# EAGLE design Piglet v1.5.3 (EAGLE 7.7.0)
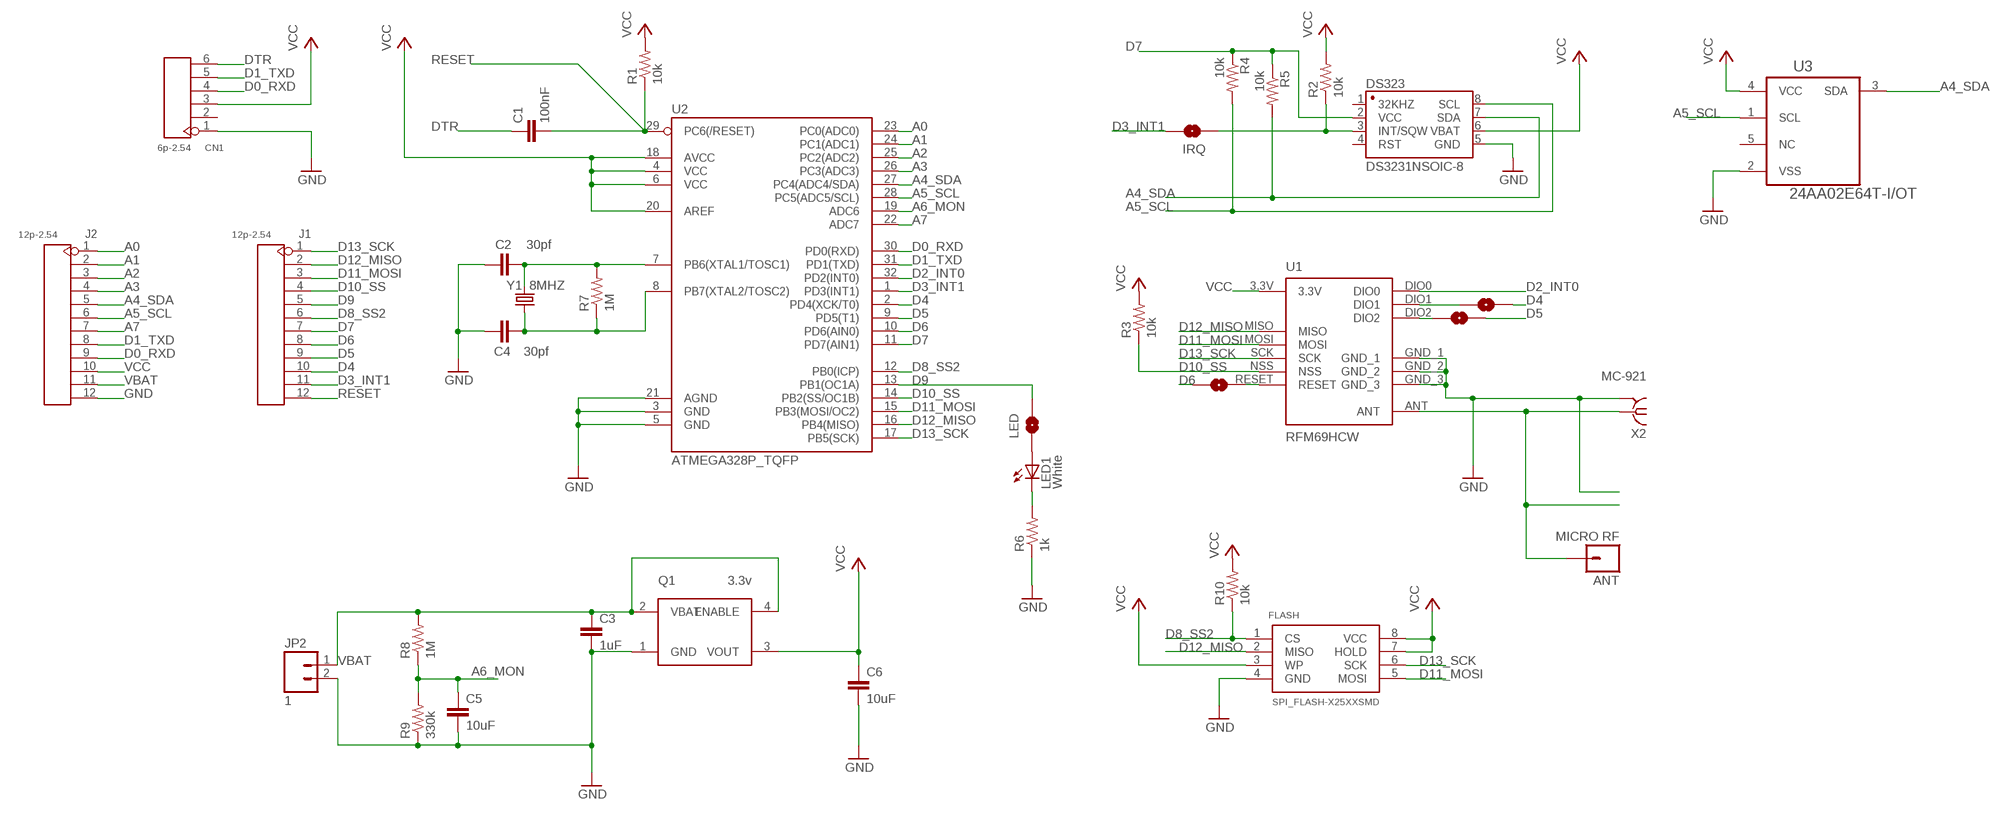
[diagram p0: schematic, sheet 1]

## Parts
ANT  MICRO RF  M01PTH  [1X01]
C1  100nF  CAP0805  [0805]
C2  30pf  CAP0805  [0805]
C3  1uF  CAP0805  [0805]
C4  30pf  CAP0805  [0805]
C5  10uF  CAP0805  [0805]
C6  10uF  CAP0805  [0805]
CN1  6p-2.54  DIP-BLACK-FEMALE-HEADER-VERT(6P-2.54)  [H6-2.54]
DS323  DS3231NSOIC-8  [DS3231MZ+TRL]
FLASH  SPI_FLASH-X25XXSMD  [SO08]
IRQ  SOLDERJUMPERNO  [SJ_2S-NO]
IRQ0  SOLDERJUMPERNO  [SJ_2S-NO]
IRQ1  SOLDERJUMPERNO  [SJ_2S-NO]
IRQ2  SOLDERJUMPERNO  [SJ_2S-NO]
J1  12p-2.54  DIP-BLACK-FEMALE-HEADER-VERT(12P-2.54)  [H12-2.54]
J2  12p-2.54  DIP-BLACK-FEMALE-HEADER-VERT(12P-2.54)  [H12-2.54]
JP2  1  MICRO_JST_2W  [M_JST_90_SMD_2]
LED  SOLDERJUMPERNO  [SJ_2S-NO]
LED1  White  LEDCHIPLED_0805  [CHIPLED_0805]
Q1  3.3v  NCP662SOT143  [SOT143]
R1  10k  RESISTOR0805-RES  [0805]
R2  10k  RESISTOR0805-RES  [0805]
R3  10k  RESISTOR0805-RES  [0805]
R4  10k  RESISTOR0805-RES  [0805]
R5  10k  RESISTOR0805-RES  [0805]
R6  1k  RESISTOR0805-RES  [0805]
R7  1M  RESISTOR0805-RES  [0805]
R8  1M  RESISTOR0805-RES  [0805]
R9  330k  RESISTOR0805-RES  [0805]
R10  10k  RESISTOR0805-RES  [0805]
U1  RFM69HCW  [RFM69HCW-XXXS2]
U2  ATMEGA328P_TQFP  [TQFP32-08]
U3  24AA02E64T-I/OT  [SOT95P270X145-5N]
X2  MC-921  [MC-921]
Y1  8MHZ  CRYSTALTXC-7A  [CRYSTAL-TXC-7A]

## Nets
A0: J2.1 U2.23(PC0(ADC0))
A1: J2.2 U2.24(PC1(ADC1))
A2: J2.3 U2.25(PC2(ADC2))
A3: J2.4 U2.26(PC3(ADC3))
A4_SDA: DS323.7(SDA) J2.5 R5.2 U2.27(PC4(ADC4/SDA)) U3.3(SDA)
A5_SCL: DS323.8(SCL) J2.6 R4.2 U2.28(PC5(ADC5/SCL)) U3.1(SCL)
A6_MON: C5.1 R8.1 R9.2 U2.19(ADC6)
A7: J2.7 U2.22(ADC7)
ANT: ANT.1 U1.ANT X2.1
D0_RXD: CN1.4 J2.9 U2.30(PD0(RXD))
D1_TXD: CN1.5 J2.8 U2.31(PD1(TXD))
D2_INT0: U1.DIO0 U2.32(PD2(INT0))
D3_INT1: IRQ.2 J1.11 U2.1(PD3(INT1))
D4: IRQ0.1 J1.10 U2.2(PD4(XCK/T0))
D5: IRQ2.1 J1.9 U2.9(PD5(T1))
D6: IRQ1.2 J1.8 U2.10(PD6(AIN0))
D7: DS323.2(VCC) J1.7 R4.1 R5.1 U2.11(PD7(AIN1))
D8_SS2: FLASH.1(CS) J1.6 R10.1 U2.12(PB0(ICP))
D9: J1.5 LED.2 U2.13(PB1(OC1A))
D10_SS: J1.4 R3.1 U1.NSS U2.14(PB2(SS/OC1B))
D11_MOSI: FLASH.5(MOSI) J1.3 U1.MOSI U2.15(PB3(MOSI/OC2))
D12_MISO: FLASH.2(MISO) J1.2 U1.MISO U2.16(PB4(MISO))
D13_SCK: FLASH.6(SCK) J1.1 U1.SCK U2.17(PB5(SCK))
DTR: C1.1 CN1.6
GND: C2.1 C3.2 C4.1 C5.2 C6.2 CN1.1 DS323.5(GND) FLASH.4(GND) J2.12 JP2.2 Q1.1(GND) R6.1 R9.1 U1.GND_1 U1.GND_2 U1.GND_3 U2.3(GND) U2.5(GND) U2.21(AGND) U3.2(VSS) X2.2@1(GND) X2.2@2(GND)
N$1: LED1.C R6.2
N$3: IRQ2.2 U1.DIO2
N$4: DS323.3(INT/SQW) IRQ.1 R2.1
N$5: C2.2 R7.2 U2.7(PB6(XTAL1/TOSC1)) Y1.P$2
N$6: C4.2 R7.1 U2.8(PB7(XTAL2/TOSC2)) Y1.P$1
N$8: LED1.A LED.1
N$9: IRQ0.2 U1.DIO1
N$11: IRQ1.1 U1.RESET
RESET: C1.2 J1.12 R1.1 U2.29(PC6(/RESET))
VBAT: C3.1 J2.11 JP2.1 Q1.2(VBAT) Q1.4(ENABLE) R8.2
VCC: C6.1 CN1.3 DS323.6(VBAT) FLASH.3(WP) FLASH.7(HOLD) FLASH.8(VCC) J2.10 Q1.3(VOUT) R1.2 R2.2 R3.2 R10.2 U1.3.3V U2.4(VCC) U2.6(VCC) U2.18(AVCC) U2.20(AREF) U3.4(VCC)
Unconnected: CN1.2 DS323.1(32KHZ) DS323.4(RST) U3.5(NC)

## Library data of the parts
ANT = SparkFun-Connectors:M01: Header 1 Standard 1-pin 0.1" header. Use with straight break away headers (SKU : PRT-00116), right angle break away headers (PRT-00553), swiss pins (PRT-00743), machine pins (PRT-00117), and female headers (PRT-00115).
C1-C6 = doug:CAP: Capacitor Standard 0603 ceramic capacitor, and 0.1" leaded capacitor.
CN1 = Seeed-OPL-Connector:DIP-BLACK-FEMALE-HEADER-VERT(6P-2.54): 320030060; MPN: F185-1106A1BSYC1
DS323 = doug:DS3231: A placeholder for generic narrow & wide SOIC8 foorptints - used on the DIP adapter board.; PROD_ID: IC-10141
FLASH = SparkFun-DigitalIC:SPI_FLASH-X25XX: 8pin SPI Flash series x25xx. Works with devices like W25X32 and BR25L32
IRQ IRQ0 IRQ1 IRQ2 LED = SparkFun-Retired:SOLDERJUMPER: Solder Jumper Standard SMD solder jumper. Used to automate production. Two varients : Normally Open and Normally Closed are the same, but have different paste layers. NC will have a large amount of paste and should jumper during reflow.
J1 J2 = Seeed-OPL-Connector:DIP-BLACK-FEMALE-HEADER-VERT(12P-2.54): 320030117; MPN: F185-1112A0BSYA1
JP2 = doug:MICRO_JST_2W: Header 5 Standard 5-pin 0.1" header. Use with straight break away headers (SKU : PRT-00116), right angle break away headers (PRT-00553), swiss pins (PRT-00743), machine pins (PRT-00117), and female headers (PRT-00115). Molex polarized connector foot print use with SKU : PRT-08230 with associated crimp pins and housings.
LED1 = led:LED: LED OSRAM: - CHIPLED LG R971, LG N971, LY N971, LG Q971, LY Q971, LO R971, LY R971 LH N974, LH R974 LS Q976, LO Q976, LY Q976 LO Q996 - Hyper CHIPLED LW Q18S LB Q993, LB Q99A, LB R99A - SideLED LS A670, LO A670, LY A670, LG A670, LP A670 LB A673, LV A673, LT A673, LW A673 LH A674 LY A675 LS A676, LA A676, LO A676, LY A676, LW A676 LS A679, LY A679, LG A679 - Hyper Micro SIDELED® LS Y876, LA Y876, LO Y876, LY Y876 LT Y87S - SmartLED LW L88C, LW L88S LB L89C, LB L89S, LG L890 LS L89K, LO L89K, LY L89K LS L896, LA L896, LO L896, LY L896 - TOPLED LS T670, LO T670, LY T670, LG T670, LP T670 LSG T670, LSP T670, LSY T670, LOP T670, LYG T670 LG T671, LOG T671, LSG T671 LB T673, LV T673, LT T673, LW T673 LH T674 LS T676, LA T676, LO T676, LY T676, LB T676, LH T676, LSB T676, LW T676 LB T67C, LV T67C, LT T67C, LS T67K, LO T67K, LY T67K, LW E67C LS E67B, LA E67B, LO E67B, LY E67B, LB E67C, LV E67C, LT E67C LW T67C LS T679, LY T679, LG T679 LS T770, LO T770, LY T770, LG T770, LP T770 LB T773, LV T773, LT T773, LW T773 LH T774 LS E675, LA E675, LY E675, LS T675 LS T776, LA T776, LO T776, LY T776, LB T776 LHGB T686 LT T68C, LB T68C - Hyper Mini TOPLED® LB M676 - Mini TOPLED Santana® LG M470 LS M47K, LO M47K, LY M47K Source: http://www.osram.convergy.de LUXEON: - LUMILED® LXK2-PW12-R00, LXK2-PW12-S00, LXK2-PW14-U00, LXK2-PW14-V00 LXK2-PM12-R00, LXK2-PM12-S00, LXK2-PM14-U00 LXK2-PE12-Q00, LXK2-PE12-R00, LXK2-PE12-S00, LXK2-PE14-T00, LXK2-PE14-U00 LXK2-PB12-K00, LXK2-PB12-L00, LXK2-PB12-M00, LXK2-PB14-N00, LXK2-PB14-P00, LXK2-PB14-Q00 LXK2-PR12-L00, LXK2-PR12-M00, LXK2-PR14-Q00, LXK2-PR14-R00 LXK2-PD12-Q00, LXK2-PD12-R00, LXK2-PD12-S00 LXK2-PH12-R00, LXK2-PH12-S00 LXK2-PL12-P00, LXK2-PL12-Q00, LXK2-PL12-R00 Source: www.luxeon.com KINGBRIGHT: KA-3528ASYC Source: www.kingbright.com
Q1 = doug:NCP662: NCP662 100 mA CMOS Low Iq Low-Dropout Voltage Regulator
R1-R10 = doug:RESISTOR: Resistor Basic schematic elements and footprints for 0603, 1206, and PTH resistors.
U1 = doug:RFM69H
U2 = doug:ATMEGA328P_TQFP; PROD_ID: IC-09069
U3 = Microchip-24AA02E64T-I_OT:24AA02E64T-I/OT: 2K I2C™ Serial EEPROMs, SOT23-5; MPN: 24AA02E64T-I/OT; OC_FARNELL: 2345567; OC_NEWARK: 01X0461; PACKAGE: SOT23-5; SUPPLIER: Microchip
X2 = con-coax:MC-921: COAX. MICROWAVE CONNECTOR O/D diam 2.1 Source: www.tycoelectronics.com .. Electronics .. ENG_CD_1775146_A2.pdf; OC_FARNELL: unknown; OC_NEWARK: unknown
Y1 = SparkFun-FreqCtrl:CRYSTAL: Various standard crystals. Proven footprints.

## Board
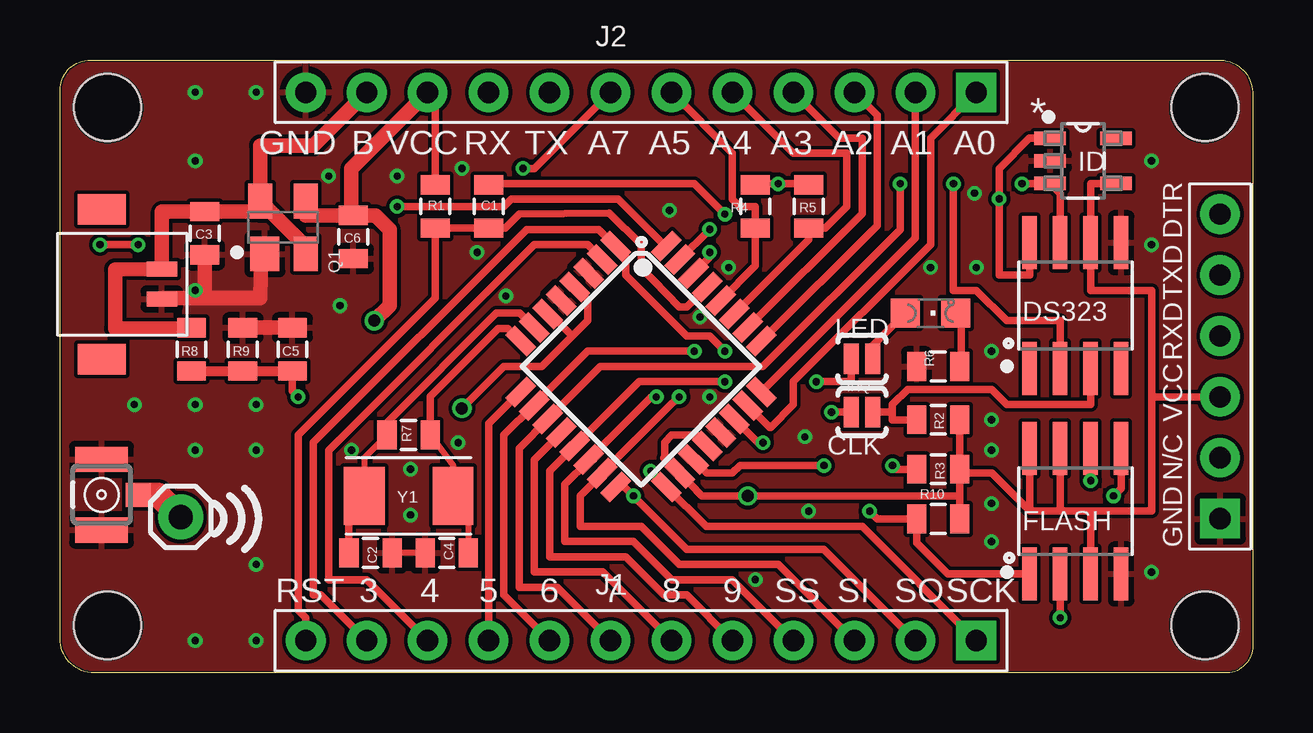
[diagram p1: board, top side]
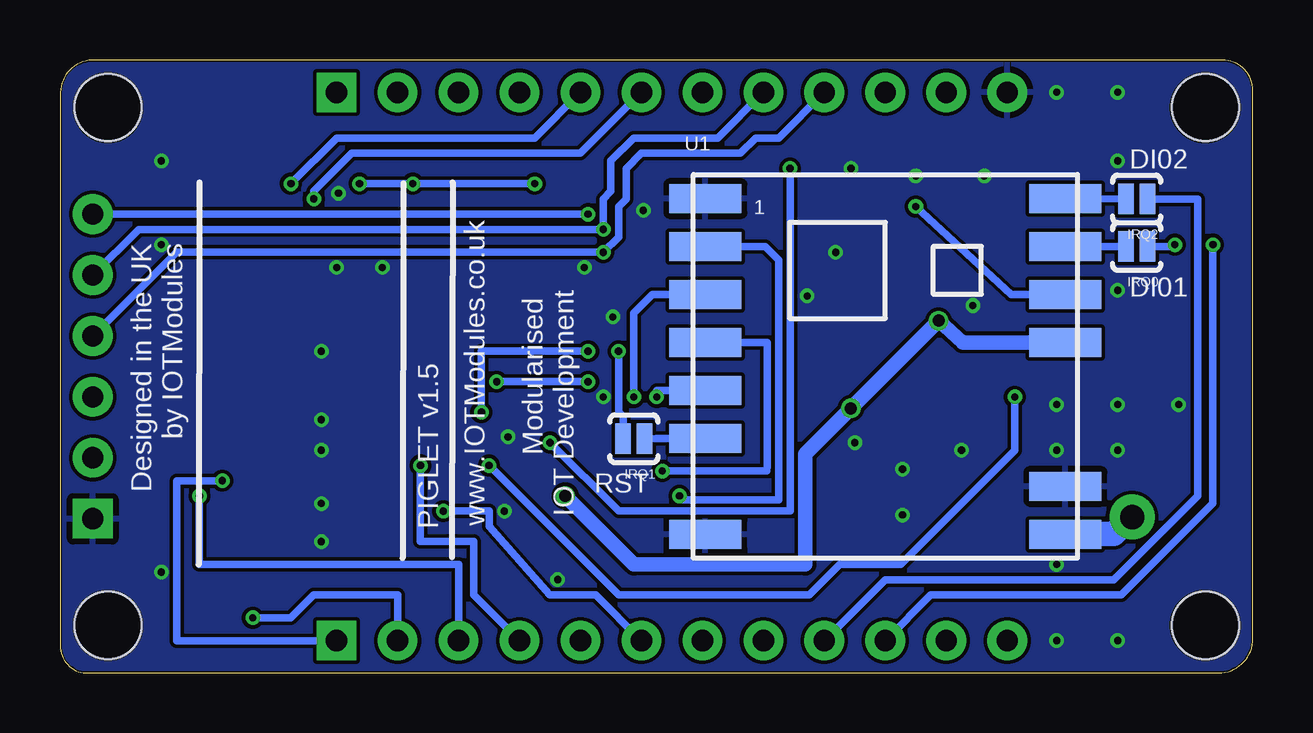
[diagram p2: board, bottom side, seen from below]

Size 49.71 x 25.56 mm. Coordinates in mm from the lower left corner, seen from the top.
Outline: 0,1.43 0,24.29 arc-90 1.27,25.56 48.26,25.56 arc-90 49.69,24.21 49.69,1.35 arc-90 48.74,0 1.43,0 arc-90 0,1.43
Copper layers (1*16): Top 0.035mm / dielectric 1.5mm / Bottom 0.035mm
Design rules "SeeedStudio_2layer_DRU_no_angle_20140221 *": minimum track width 6mil, minimum drill 0.3mm, track to track 6mil, track to pad 6mil, pad to pad 6mil, via to via 6mil, smd to smd 0mil, copper to edge 3mil, drill to drill 10mil, minimum pad ring 10mil, minimum via ring 6mil, stop-mask expansion 2mil, vias tented up to drill 100mil, thermal gap 10mil
Holes 2.8 mm at 1.98,23.57 1.98,1.98 47.7,23.57 47.7,1.98

### Footprints (pad centres in the part's own frame; a part is rotated, then mirrored left to right if it is on the bottom)
1X01 = drill 1.016 pad 1.88: 1 0,0
0805 = smd 0.8 x 1.2: 1 -0.9,0; 2 0.9,0
H6-2.54 = drill 0.889 pad 1.651 square: 1 0,6.35 | drill 0.889 pad 1.651: 2 0,3.81; 3 0,1.27; 4 0,-1.27; 5 0,-3.81; 6 0,-6.35
DS3231MZ+TRL = smd 0.61 x 2.21: 1 -1.905,-2.616; 2 -0.635,-2.616; 3 0.635,-2.616; 4 1.905,-2.616; 5 1.905,2.616; 6 0.635,2.616; 7 -0.635,2.616; 8 -1.905,2.616
SO08 = smd 0.61 x 2.21: 1 -1.905,-2.616; 2 -0.635,-2.616; 3 0.635,-2.616; 4 1.905,-2.616; 5 1.905,2.616; 6 0.635,2.616; 7 -0.635,2.616; 8 -1.905,2.616
SJ_2S-NO = smd 0.635 x 1.27: 1 -0.45,0; 2 0.45,0
H12-2.54 = drill 0.889 pad 1.651 square: 1 0,13.97 | drill 0.889 pad 1.651: 2 0,11.43; 3 0,8.89; 4 0,6.35; 5 0,3.81; 6 0,1.27; 7 0,-1.27; 8 0,-3.81; 9 0,-6.35; 10 0,-8.89; 11 0,-11.43; 12 0,-13.97
M_JST_90_SMD_2 = smd 0.635 x 1.27: 1 4.375,2.5; 2 3.125,2.5 | smd 1.27 x 2: P$1 0.625,5; P$2 6.875,5
CHIPLED_0805 = smd 1.2 x 1.2: A 0,-1.05; C 0,1.05
SOT143 = smd 1.2 x 1.44: 1 -0.75,-1.1 | smd 1 x 1.44: 2 0.95,-1.1; 3 0.95,1.1; 4 -0.95,1.1
RFM69HCW-XXXS2 = smd 3 x 1.2: 3.3V 7.5,1; ANT 7.5,-7; DIO0 7.5,3; DIO1 7.5,5; DIO2 7.5,7; GND_1 7.5,-5; GND_2 -7.5,-7; GND_3 -7.5,7; MISO -7.5,5; MOSI -7.5,3; NSS -7.5,-1; RESET -7.5,-3; SCK -7.5,1
TQFP32-08 = smd 1.27 x 0.559: 1 -4.293,2.8; 2 -4.293,2; 3 -4.293,1.2; 4 -4.293,0.4; 5 -4.293,-0.4; 6 -4.293,-1.2; 7 -4.293,-2; 8 -4.293,-2.8; 17 4.293,-2.8; 18 4.293,-2; 19 4.293,-1.2; 20 4.293,-0.4; 21 4.293,0.4; 22 4.293,1.2; 23 4.293,2; 24 4.293,2.8 | smd 0.559 x 1.27: 9 -2.8,-4.293; 10 -2,-4.293; 11 -1.2,-4.293; 12 -0.4,-4.293; 13 0.4,-4.293; 14 1.2,-4.293; 15 2,-4.293; 16 2.8,-4.293; 25 2.8,4.293; 26 2,4.293; 27 1.2,4.293; 28 0.4,4.293; 29 -0.4,4.293; 30 -1.2,4.293; 31 -2,4.293; 32 -2.8,4.293
SOT95P270X145-5N = smd 1.321 x 0.559: 1 -1.372,0.94; 2 -1.372,0; 3 -1.372,-0.94; 4 1.372,-0.94; 5 1.372,0.94
MC-921 = smd 1 x 1.05: 1 0,1.528 | smd 1.05 x 2.2: 2@1 -1.475,0; 2@2 1.475,0
CRYSTAL-TXC-7A = smd 1.7 x 2.4: P$1 1.85,0; P$2 -1.85,0

### Placement (x,y rotation side)
ANT  5.03,6.5 0 top
C1  17.86,19.45 270 top
C2  12.94,5 180 top
C3  6.03,18.34 270 top
C4  16.11,5 0 top
C5  9.68,13.49 90 top
C6  12.22,18.18 270 top
CN1  48.34,12.78 180 top
DS323  42.31,15.32 0 top
FLASH  42.31,6.75 0 top
IRQ  33.42,10.87 180 top
IRQ0  4.84,17.78 180 bottom
IRQ1  25.8,9.76 180 bottom
IRQ2  4.84,19.76 180 bottom
J1  24.21,1.35 270 top
J2  24.21,24.21 270 top
JP2  6.75,12.46 90 top
LED  33.42,13.1 180 top
LED1  36.27,15 270 top
Q1  9.29,18.57 0 top
R1  15.64,19.45 90 top
R2  36.59,10.56 0 top
R3  36.59,8.49 0 top
R4  28.97,19.45 270 top
R5  31.19,19.45 270 top
R6  36.59,12.78 0 top
R7  14.53,9.92 180 top
R8  5.48,13.49 90 top
R9  7.62,13.49 270 top
R10  36.59,6.43 0 top
U1  15.32,12.78 0 bottom
U2  24.21,12.78 315 top
U3  42.62,21.35 0 top
X2  1.73,7.43 270 top
Y1  14.53,7.38 0 top

### Tracks (layer width: path | path; a pad name or v marks a point on that pad's centre or on a via)
A0
  Top 0.305: U2.23 29.58,10.24 29.61,10.24 30.56,11.19 30.56,12.14 36.27,17.86 36.27,22.3 J2.1
A1
  Top 0.305: U2.24 35.64,18.14 J2.2
A2
  Top 0.305: U2.25 34.05,18.66 34.05,23.26 J2.3
A3
  Top 0.305: U2.26 33.42,19.16 33.42,22.3 32.46,22.3 J2.4
A4_SDA  (via drill 0.3)
  Top 0.305: U2.27 31.19,18.07 R5.2 31.88,18.55 32.78,19.45 32.78,21.67 30.56,21.67 J2.5 | v40.08,20.4 40.71,20.41 U3.3 41.67,19.99 DS323.7
  Bottom 0.305: v40.08,20.4 38.18,22.3 29.92,22.3 J2.5
A5_SCL  (via drill 0.3)
  Top 0.305: U2.28 28.97,16.98 R4.2 28.97,19.45 28.34,19.45 28.02,19.76 28.02,21.67 J2.6 | DS323.8 40.4,16.59 39.13,16.59 v39.13,19.76 39.13,21.03 40.39,22.29 U3.1
  Bottom 0.305: J2.6 28.02,21.67 37.54,21.67 39.13,20.08 v39.13,19.76
A6_MON  (via drill 0.3)
  Top 0.305: 26.51,8.9 U2.19 26.96,8.33 28.02,8.33 28.34,8.65 v31.83,8.65 | v9.92,11.51 9.68,11.75 C5.1
  Top 0.406: R8.1 R9.2 C5.1
  Bottom 0.305: v31.83,8.65 26.43,3.25 18.49,3.25 17.22,4.52 14.68,4.52 9.92,9.29 v9.92,11.51
A7  (via drill 0.3)
  Top 0.305: v19.29,21.03 19.76,21.03 J2.7 | U2.22 29.08,9.6 v29.29,9.6
  Bottom 0.305: v29.29,9.6 26.43,6.75 19.29,6.75 v19.29,21.03
ANT
  Top 1.016: ANT.1 4.1,7.43 X2.1
  Bottom 0.61: ANT.1 5.09,6.5 | 7.8,5.79 U1.ANT
  Bottom 1.016: 5.09,6.5 5.79,5.79 7.8,5.79
D0_RXD  (via drill 0.3)
  Top 0.305: v27.07,17.54 27.07,17.33 U2.30
  Bottom 0.305: CN1.4 44.85,17.54 v27.07,17.54 26.43,18.18 26.43,19.45 26.11,19.76 26.11,21.03 25.48,21.67 21.35,21.67 20.72,22.3 19.76,22.3 J2.9
D1_TXD  (via drill 0.3)
  Top 0.305: U2.31 25.83,17.26 v27.07,18.49
  Bottom 0.305: CN1.5 46.43,18.49 v27.07,18.49 27.07,19.76 26.75,20.08 26.75,21.35 25.8,22.3 22.3,22.3 J2.8
D2_INT0  (via drill 0.3)
  Top 0.305: U2.32 25.23,17.79 23.26,19.76 18.81,19.76 18.49,19.45 v14.05,19.45
  Bottom 0.305: v14.05,19.45 10.06,15.78 U1.DIO0
D3_INT1  (via drill 0.3)
  Top 0.305: U2.1 23.15,17.96 | J1.11 10.87,3.25 10.56,3.25 10.56,9.6 19.45,18.49 22.45,18.49 U2.1 | v27.7,13.41 27.07,14.05 26.11,14.05 23.57,16.59 23.57,17.37 U2.1 | v32.15,10.87 IRQ.2
  Bottom 0.305: v27.7,13.41 32.15,13.41 v32.15,10.87
D4  (via drill 0.3)
  Top 0.305: U2.2 22.59,17.26 21.99,17.86 19.76,17.86 11.19,9.29 11.19,3.89 12.78,3.89 J1.10 | v3.25,17.86 v1.67,17.86
  Bottom 0.305: J1.10 13.41,3.25 5.48,3.25 1.67,7.06 v1.67,17.86 | v3.25,17.86 3.33,17.78 IRQ0.1
D5
  Top 0.305: J1.9 17.86,10.4 U2.9
  Bottom 0.305: IRQ2.1 2.3,19.76 2.3,7.38 5.79,3.89 15.32,3.89 J1.9
D6  (via drill 0.3)
  Top 0.305: J1.8 18.49,3.25 18.49,9.92 19.73,11.16 U2.10 19.76,11.19 21.99,13.41 v26.43,13.41
  Bottom 0.305: v26.43,13.41 26.43,10.87 26.25,10.69 IRQ1.2
D7  (via drill 0.3)
  Top 0.305: J1.7 20.72,3.57 19.13,3.57 19.13,9.37 20.33,10.56 U2.11 | U2.11 20.33,10.72 | v35,20.4 35,18.49 29.29,12.78 22.51,12.78 U2.11 | R4.1 29.02,20.4 v29.92,20.4 31.14,20.4 R5.1 | DS323.2 41.67,14.68 39.45,14.68 38.18,15.95 37.23,15.95 v37.23,20.4
  Bottom 0.305: v29.92,20.4 v35,20.4 v37.23,20.4
D8_SS2  (via drill 0.3)
  Top 0.305: J1.6 22.62,4.21 19.76,4.21 19.76,8.89 U2.12 | v33.73,6.75 34.05,6.43 R10.1 35.69,5.42 36.99,4.13 FLASH.1
  Bottom 0.305: v33.73,6.75 31.83,6.75 31.83,6.11 29.29,3.25 27.38,3.25 J1.6
D9  (via drill 0.3)
  Top 0.305: J1.5 26.11,3.25 25.16,3.25 23.57,4.84 20.4,4.84 20.4,8.41 21.45,9.46 U2.13 | U2.13 21.53,9.46 | v31.51,12.14 32.97,12.14 LED.2 | v27.7,12.14 24.14,12.14 U2.13
  Bottom 0.305: v27.7,12.14 v31.51,12.14
D10_SS  (via drill 0.3)
  Top 0.305: J1.4 28.02,3.89 25.48,3.89 23.89,5.48 21.03,5.48 21.03,7.86 22.02,8.85 U2.14 | U2.14 22.23,8.9 | v24.84,11.51 24.64,11.51 U2.14 | R3.1 34.85,8.49 v34.69,8.65
  Bottom 0.305: v24.84,11.51 24.84,11.78 U1.NSS | v34.69,8.65 34.69,5.48 32.46,5.48 32.46,3.25 J1.4
D11_MOSI  (via drill 0.3)
  Top 0.305: J1.3 29.92,4.52 25.8,4.52 24.21,6.11 21.67,6.11 21.67,7.38 22.59,8.3 U2.15 25.45,11.19 v25.8,11.51 | FLASH.5 44.21,7.7 v43.89,7.38
  Bottom 0.305: v25.8,11.51 25.8,15 25.02,15.78 U1.MOSI | v43.89,7.38 43.89,4.52 33.1,4.52 J1.3
D12_MISO  (via drill 0.3)
  Top 0.305: J1.2 31.83,5.16 26.11,5.16 23.51,7.76 U2.16 23.33,7.94 v23.89,7.38 | v41.67,2.3 FLASH.2
  Bottom 0.305: v41.67,2.3 40.08,2.3 39.13,3.25 35.64,3.25 J1.2 | v23.89,7.38 23.73,7.22 19.76,7.22 19.76,17.22 20.32,17.78 U1.MISO
D13_SCK  (via drill 0.3)
  Top 0.305: J1.1 33.42,6.11 26.92,6.11 U2.17 v24.61,8.42 | FLASH.6 v42.94,8.02
  Bottom 0.305: v42.94,8.02 44.85,8.02 44.85,1.35 J1.1 | U1.SCK 20.24,13.78 20.24,8.65 20.25,8.41 v24.61,8.42
DTR  (via drill 0.3)
  Top 0.305: C1.1 18.18,20.4 26.43,20.4 v27.7,19.13
  Bottom 0.305: v27.7,19.13 CN1.6
GND  (via drill 0.3)
  Top 0.254: C2.1 C4.1 15.32,4.89
  Top 0.61: 8.02,14.37 R9.1 C5.2 | Q1.1 8.39,17.47 8.33,15.64 6.03,15.64 | C3.2 6.03,15.64 | 6.03,15.64 4.3,15.64 JP2.2
  other vias: 36.27,16.91 38.81,13.41 27.07,11.51 16.59,9.6 31.04,9.84 31.19,6.75 38.81,9.29 38.81,10.56 28.97,3.89 18.57,15.72 25.4,19.29 11.19,20.72 16.75,21.03 12.14,9.29 26.67,14.84 27.86,16.91 17.38,17.54 14.05,20.72 14.61,8.49 14.61,6.59 3.1,11.19 8.18,11.19 8.18,9.29 8.18,4.52 8.18,1.35 5.64,1.35 11.67,15.32 5.64,15.95 5.64,11.19 5.64,9.29 5.64,21.35 5.64,24.21 8.18,24.21 38.81,5.48 38.81,7.06 45.48,4.21 45.48,17.86 45.48,21.35 38.1,20 38.18,16.91
  pour Top: 0.08,24.21 0.08,1.35 arc90 1.35,0.08 48.34,0.08 arc90 49.61,1.35 49.61,24.21 arc90 48.34,25.48 1.35,25.48 arc90
  pour Bottom: 0.08,24.21 0.08,1.35 arc90 1.35,0.08 48.34,0.08 arc90 49.61,1.35 49.61,24.21 arc90 48.34,25.48 1.35,25.48 arc90
N$1
  Top 0.305: LED1.C 37.54,14.68 37.54,13.1 R6.2
N$3
  Bottom 0.305: IRQ2.2 U1.DIO2
N$4
  Top 0.305: IRQ.1 34.69,10.87 | 34.69,10.87 34.69,11.19 35.32,11.83 38.81,11.83 39.45,11.19 42.94,11.19 DS323.3 | 34.69,10.87 34.69,10.56 R2.1
N$5
  Top 0.254: R7.2 12.68,8.97 Y1.P$2
  Top 0.305: C2.2 12.04,6.74 Y1.P$2 | R7.2 13.63,10.45 18.18,15 19.16,15 U2.7
N$6
  Top 0.254: R7.1 16.38,8.65 Y1.P$1 17.01,6.74 C4.2
  Top 0.305: U2.8 18.66,14.37 18.26,14.37 15.43,11.54 R7.1
N$8
  Top 0.305: LED.1 33.87,13.64 LED1.A
N$9
  Bottom 0.305: IRQ0.2 U1.DIO1
N$11
  Bottom 0.305: IRQ1.1 24.85,9.78 U1.RESET
RESET
  Top 0.305: J1.12 10.24,2.3 9.92,2.62 9.92,9.92 15.64,15.64 R1.1 C1.2 18.55,18.55 19.13,19.13 22.89,19.18 24.21,17.86 24.21,16.91 25.8,15.25 26.11,15.25 U2.29
VBAT
  Top 0.61: Q1.2 10.24,17.77 Q1.4 | R8.2 5.16,14.37 2.3,14.37 2.3,16.83 JP2.1 4.25,19.24 C3.1 8.34,19.24 Q1.4 | J2.11 10.56,21.99 8.33,21.99 Q1.4
VCC  (via drill 0.5)
  Top 0.305: U2.6 20.44,14.97 21.35,14.05 | 21.35,14.05 21.99,14.68 21.99,15.57 U2.4 | FLASH.3 42.94,6.75 | 42.94,6.75 45.48,6.75 45.48,11.51 | CN1.3 45.48,11.51 | U2.20 26.5,9.92 25.48,9.92 25.19,9.6 25.19,9 25.16,8.97 U2.18 26.75,7.38 v28.65,7.38 37.49,7.38 | 45.48,11.51 45.48,15.95 42.94,15.95 DS323.6 42.94,20.41 U3.4 | 41.67,6.75 40.4,6.75 | 40.4,6.75 38.81,8.33 37.65,8.33 R3.2 | FLASH.7 41.67,6.75 | 41.67,6.75 42.94,6.75 | FLASH.8 40.4,6.75 | R2.2 R3.2 | 21.35,14.05 20.08,12.78 18.49,12.78 v16.75,11.03 | J2.10 15.64,23.89 R1.2 | 37.49,7.38 R10.2 | 37.49,7.38 R3.2
  Top 0.61: Q1.3 10.24,19.08 C6.1 | C6.1 12.17,19.13 12.14,19.13 12.14,21.03 J2.10 | C6.1 13.15,19.08 13.73,18.49 13.73,15.32 v13.1,14.68
  Bottom 0.61: v28.65,7.38 25.8,4.52 18.65,4.52 18.65,9.13 v16.75,11.03 v13.1,14.68 12.1,13.78 U1.3.3V

### Text on the board
_tsilk: GND | B | VCC | RX | TX | A7 | A5 | A4 | A3 | A2 | A1 | A0 | ID | DTR | TXD | RXD | VCC | CLK | N/C | GND | RST | 3 | 4 | 5 | 6 | 7 | 8 | 9 | SS | SI | SO | SCK
_bsilk: DI02 | www.IOTModules.co.uk | Designed in the UK / by IOTModules | DI01 | Modularised / IOT Development | PIGLET v1.5 | RST